# EAGLE design soic16_tssop16 (EAGLE 5.11)
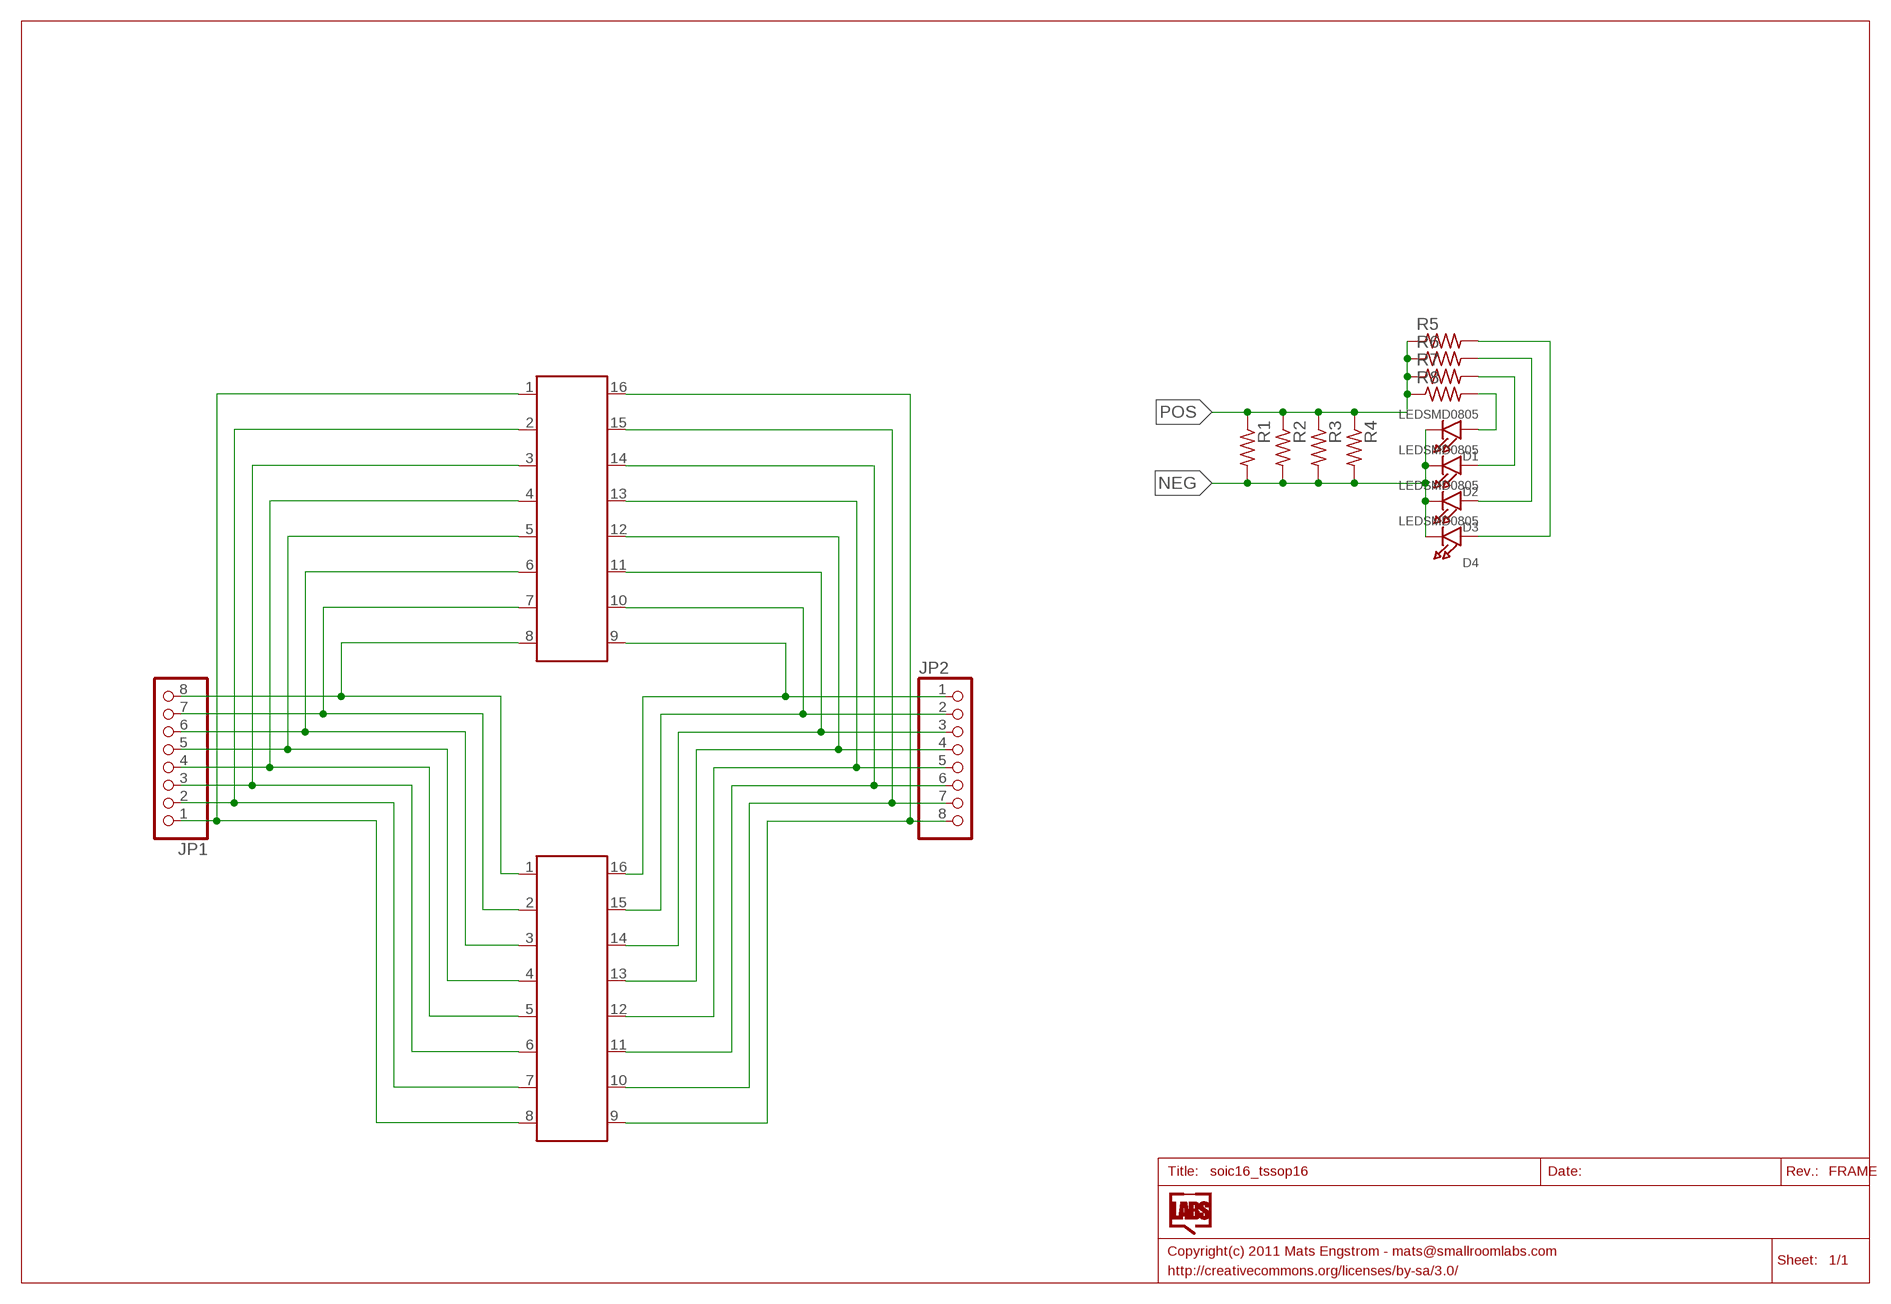
[diagram p0: schematic, sheet 1]

## Parts
D1  LEDSMD0805  [CHIPLED_0805]
D2  LEDSMD0805  [CHIPLED_0805]
D3  LEDSMD0805  [CHIPLED_0805]
D4  LEDSMD0805  [CHIPLED_0805]
IC1  IC16SOIC  [SOIC16-DW]
IC2  IC16TSSOP  [TSSOP16L]
JP1  HEADER-1X8ROUND  [1X08_ROUND]
JP2  HEADER-1X8ROUND  [1X08_ROUND]
R1  R-US_R0805W  [R0805W]
R2  R-US_R0805W  [R0805W]
R3  R-US_R0805W  [R0805W]
R4  R-US_R0805W  [R0805W]
R5  R-US_R0805W  [R0805W]
R6  R-US_R0805W  [R0805W]
R7  R-US_R0805W  [R0805W]
R8  R-US_R0805W  [R0805W]

## Nets
N$1: IC1.1 IC2.8 JP1.8
N$2: IC1.2 IC2.7 JP1.7
N$3: IC1.3 IC2.6 JP1.6
N$4: IC1.4 IC2.5 JP1.5
N$5: IC1.5 IC2.4 JP1.4
N$6: IC1.6 IC2.3 JP1.3
N$7: IC1.7 IC2.2 JP1.2
N$8: IC1.8 IC2.1 JP1.1
N$9: IC1.16 IC2.9 JP2.1
N$10: IC1.15 IC2.10 JP2.2
N$11: IC1.14 IC2.11 JP2.3
N$12: IC1.13 IC2.12 JP2.4
N$13: IC1.12 IC2.13 JP2.5
N$14: IC1.11 IC2.14 JP2.6
N$15: IC1.10 IC2.15 JP2.7
N$16: IC1.9 IC2.16 JP2.8
N$18: D1.A R8.2
N$19: D2.A R7.2
N$20: D3.A R6.2
N$21: D4.A R5.2
NEG: D1.C D2.C D3.C D4.C R1.2 R2.2 R3.2 R4.2
POS: R1.1 R2.1 R3.1 R4.1 R5.1 R6.1 R7.1 R8.1

## Library data of the parts
D1-D4 = SmallRoomLabs:LED
IC1 IC2 = SmallRoomLabs:IC16
JP1 JP2 = microbuilder:HEADER-1X8: PIN HEADER
R1-R8 = adafruit:R-US_: RESISTOR, American symbol

## Net classes
0 default: width 0.203 mm, clearance 0.203 mm

## Board
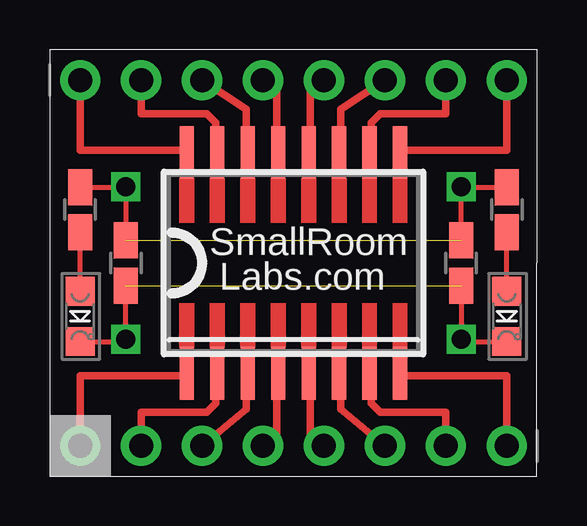
[diagram p1: board, top side]
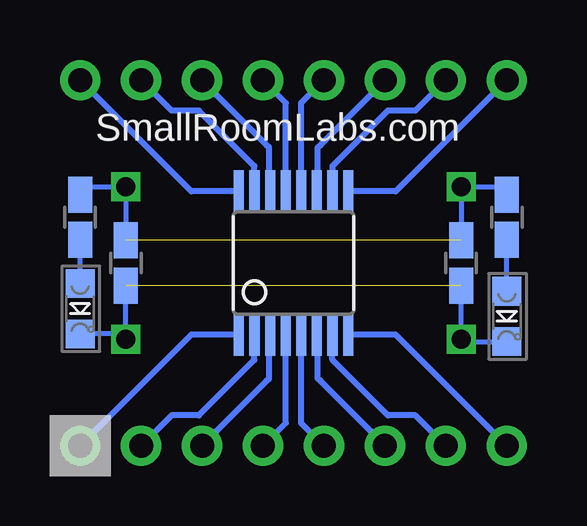
[diagram p2: board, bottom side, seen from below]

No outline drawn. Coordinates in mm, seen from the top.
Copper layers (1*16): Top 0.035mm / dielectric 1.5mm / Bottom 0.035mm
Design rules "Fusion_eagle_rule_v1.1": minimum track width 6mil, minimum drill 12mil, track to track 6mil, track to pad 6mil, pad to pad 6mil, via to via 6mil, smd to smd 0mil, copper to edge 10mil, drill to drill 10mil, minimum pad ring 10mil, minimum via ring 6mil, stop-mask expansion 2mil, vias tented up to drill 100mil, thermal gap 10mil

### Footprints (pad centres in the part's own frame; a part is rotated, then mirrored left to right if it is on the bottom)
CHIPLED_0805 = smd 1.2 x 1.2: A 0,-1.05; C 0,1.05
SOIC16-DW = smd 0.6 x 2.2: 1 -4.445,-4.6; 2 -3.175,-4.6; 3 -1.905,-4.6; 4 -0.635,-4.6; 5 0.635,-4.6; 6 1.905,-4.6; 7 3.175,-4.6; 8 4.445,-4.6; 9 4.445,4.6; 10 3.175,4.6; 11 1.905,4.6; 12 0.635,4.6; 13 -0.635,4.6; 14 -1.905,4.6; 15 -3.175,4.6; 16 -4.445,4.6
TSSOP16L = smd 0.42 x 1.78: 1 -2.275,-2.97; 2 -1.625,-2.97; 3 -0.975,-2.97; 4 -0.325,-2.97; 5 0.325,-2.97; 6 0.975,-2.97; 7 1.625,-2.97; 8 2.275,-2.97; 9 2.275,2.97; 10 1.625,2.97; 11 0.975,2.97; 12 0.325,2.97; 13 -0.325,2.97; 14 -0.975,2.97; 15 -1.625,2.97; 16 -2.275,2.97
1X08_ROUND = drill 1 pad 1.676 round: 1 -8.89,0; 2 -6.35,0; 3 -3.81,0; 4 -1.27,0; 5 1.27,0; 6 3.81,0; 7 6.35,0; 8 8.89,0
R0805W = smd 1.5 x 1: 1 -0.94,0; 2 0.94,0

### Placement (x,y rotation side)
D1  19.05,6.99 180 bottom
D2  1.27,6.67 180 bottom
D3  19.05,6.67 180 top
D4  1.27,6.67 180 top
IC1  10.16,8.89 0 top
IC2  10.16,8.89 0 bottom
JP1  10.16,1.27 180 top
JP2  10.16,16.51 0 top
R1  3.17,8.89 270 top
R2  17.14,8.89 270 top
R3  3.17,8.89 270 bottom
R4  17.14,8.89 270 bottom
R5  1.27,11.11 270 top
R6  19.05,11.11 270 top
R7  1.27,10.79 270 bottom
R8  19.05,10.79 270 bottom

### Tracks (layer width: path | path; a pad name or v marks a point on that pad's centre or on a via)
N$1
  Top 0.305: JP1.8 1.27,4.19 5.71,4.19 IC1.1
  Bottom 0.254: JP1.8 5.91,5.91 7.87,5.91 IC2.8
N$2
  Top 0.305: JP1.7 3.81,2.67 6.54,2.67 6.92,3.05 6.92,3.81 6.99,4.19 IC1.2
  Bottom 0.254: JP1.7 5.08,2.54 6.22,2.54 8.53,4.85 IC2.7
N$3
  Top 0.305: JP1.6 8.19,2.79 8.19,3.81 8.26,4.19 IC1.3
  Bottom 0.254: IC2.6 9.14,5.88 9.14,4.06 9.04,3.99 6.35,1.29 JP1.6
N$4
  Top 0.305: JP1.5 9.46,1.52 9.46,3.81 9.53,4.19 IC1.4
  Bottom 0.254: JP1.5 9.84,2.22 9.84,5.91 IC2.5
N$5
  Top 0.305: JP1.4 10.86,1.52 10.86,3.81 10.79,4.19 IC1.5
  Bottom 0.254: JP1.4 10.48,2.22 10.48,5.91 IC2.4
N$6
  Top 0.305: JP1.3 12.13,2.79 12.13,4.13 12.06,4.19 IC1.6
  Bottom 0.254: IC2.3 11.18,5.88 11.18,4.06 11.28,3.99 13.97,1.29 JP1.3
N$7
  Top 0.305: JP1.2 16.51,2.67 13.78,2.67 13.4,3.05 13.4,3.81 13.34,4.19 IC1.7
  Bottom 0.254: JP1.2 15.24,2.54 14.1,2.54 11.79,4.85 IC2.2
N$8
  Top 0.305: JP1.1 19.05,4.19 14.61,4.19 IC1.8
  Bottom 0.254: JP1.1 14.41,5.91 12.45,5.91 IC2.1
N$9
  Top 0.305: JP2.1 1.27,13.59 5.71,13.59 IC1.16
  Bottom 0.254: JP2.1 5.91,11.87 7.87,11.87 IC2.9
N$10
  Top 0.305: JP2.2 3.81,15.11 6.54,15.11 6.92,14.73 6.92,13.97 6.99,13.59 IC1.15
  Bottom 0.254: JP2.2 5.08,15.24 6.22,15.24 8.53,12.93 IC2.10
N$11
  Top 0.305: JP2.3 8.19,15.3 8.19,13.97 8.26,13.59 IC1.14
  Bottom 0.254: IC2.11 9.14,11.9 9.14,13.72 9.04,13.79 6.35,16.48 JP2.3
N$12
  Top 0.305: JP2.4 9.46,16.26 9.46,13.97 9.53,13.59 IC1.13
  Bottom 0.254: JP2.4 9.84,15.56 9.84,11.87 IC2.12
N$13
  Top 0.305: JP2.5 10.86,16.26 10.86,13.97 10.79,13.59 IC1.12
  Bottom 0.254: JP2.5 10.48,15.56 10.48,11.87 IC2.13
N$14
  Top 0.305: JP2.6 12.13,15.3 12.13,13.97 12.06,13.59 IC1.11
  Bottom 0.254: IC2.14 11.18,11.9 11.18,13.72 11.28,13.79 13.97,16.48 JP2.6
N$15
  Top 0.305: JP2.7 16.51,15.11 13.78,15.11 13.4,14.73 13.4,13.97 13.34,13.59 IC1.10
  Bottom 0.254: JP2.7 15.24,15.24 14.1,15.24 11.79,12.93 IC2.15
N$16
  Top 0.305: JP2.8 19.05,13.59 14.61,13.59 IC1.9
  Bottom 0.254: JP2.8 14.41,11.87 12.45,11.87 IC2.16
N$18
  Bottom 0.203: D1.A R8.2
N$19
  Bottom 0.203: D2.A R7.2
N$20
  Top 0.203: D3.A R6.2
N$21
  Top 0.203: D4.A R5.2
NEG  (via drill 0.8)  (1 unrouted)
  Top 0.203: R3.2 v3.17,5.71 3.17,5.62 D4.C | R4.2 v17.14,5.71 17.14,5.62 D3.C
  Bottom 0.203: R3.2 v3.17,5.71 3.17,5.62 D4.C | D1.C 17.14,5.93 v17.14,5.71 R4.2
POS  (via drill 0.8)  (1 unrouted)
  Top 0.203: R4.1 v17.14,12.06 | R3.1 v3.17,12.06 v3.17,12.05 R5.1 R7.1 | v17.14,12.06 17.14,11.73 | R6.1 v17.14,12.05 v17.14,12.06
  Bottom 0.203: R3.1 v3.17,12.06 1.27,12.06 R7.1 | R8.1 R6.1 v17.14,12.05 v17.14,12.06 R4.1
(copper drawn outside any net)
  shapes: Top area x17

### Text on the board
tPlace: SmallRoom | Labs.com
bPlace: SmallRoomLabs.com